# Altium schematic sheet AMS_temperature.SchDoc: Temperature Sensing
size A4; CheckedBy: Àlex Sánchez i Benet; DrawnBy: Àlex Sánchez i Benet; DocumentNumber: 1; Revision: 1; SheetNumber: 4; SheetTotal: 4; University: UPC EEBE; City: Barcelona; Country: Spain; CP: 08019; Address: Av. Eduard Maristany, 16
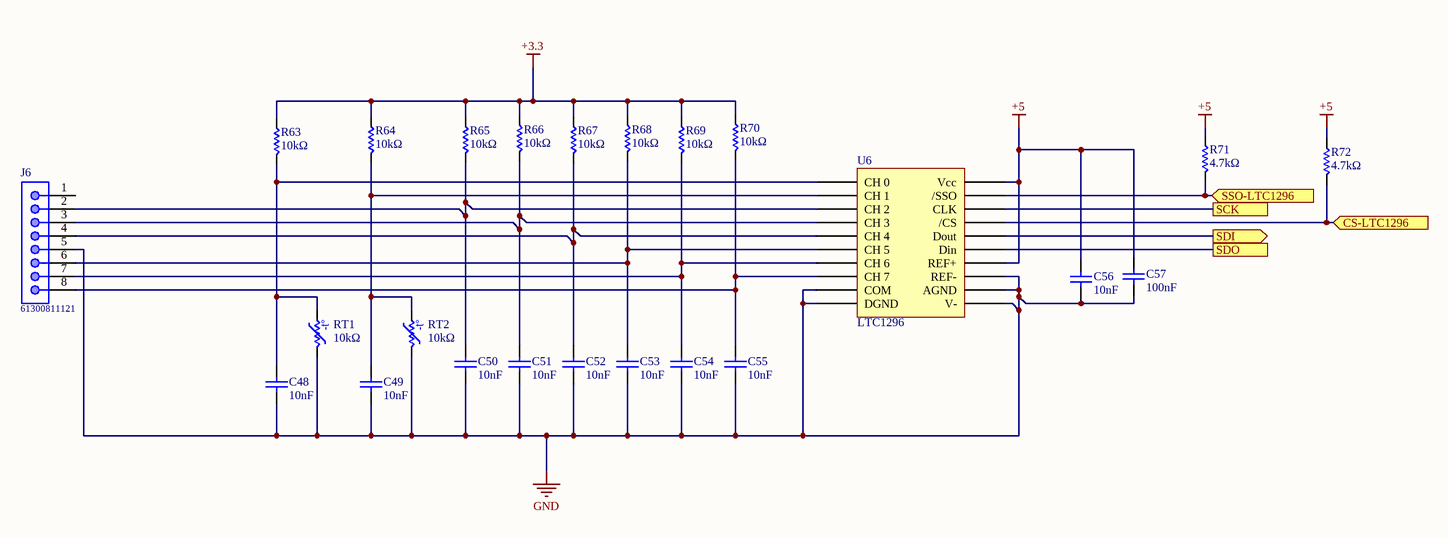
[diagram p0: AMS_temperature.SchDoc]

## Parts
C48  10nF  [0805_2x1.25x0.8mm_Reflow Soldering]
C49  10nF  [0805_2x1.25x0.8mm_Reflow Soldering]
C50  10nF  [0805_2x1.25x0.8mm_Reflow Soldering]
C51  10nF  [0805_2x1.25x0.8mm_Reflow Soldering]
C52  10nF  [0805_2x1.25x0.8mm_Reflow Soldering]
C53  10nF  [0805_2x1.25x0.8mm_Reflow Soldering]
C54  10nF  [0805_2x1.25x0.8mm_Reflow Soldering]
C55  10nF  [0805_2x1.25x0.8mm_Reflow Soldering]
C56  10nF  [0805_2x1.25x0.8mm_Reflow Soldering]
C57  100nF  [0805_2x1.25x0.8mm_Reflow Soldering]
J6  61300811121  [61300811121-bottom]
R63  10kΩ  [CR0805]
R64  10kΩ  [CR0805]
R65  10kΩ  [CR0805]
R66  10kΩ  [CR0805]
R67  10kΩ  [CR0805]
R68  10kΩ  [CR0805]
R69  10kΩ  [CR0805]
R70  10kΩ  [CR0805]
R71  4.7kΩ  [CR0805]
R72  4.7kΩ  [CR0805]
RT1  10kΩ  [NXRT15XV103FA1B040]
RT2  10kΩ  [NXRT15XV103FA1B040]
U6  LTC1296  [LTC1296]

## Ports
CS-LTC1296 (in), SCK, SDI (out), SDO, SSO-LTC1296 (in)

## Nets
+3.3: R63.2 R64.2 R65.2 R66.2 R67.2 R68.2 R69.2 R70.2
+5: C56.2 C57.2 R71.2 R72.2 U6.14(REF+) U6.20(Vcc)
GND: C48.1 C49.1 C50.1 C51.1 C52.1 C53.1 C54.1 C55.1 C56.1 C57.1 J6.5 RT1.1 RT2.1 U6.9(COM) U6.10(DGND) U6.11(V-) U6.12(AGND) U6.13(REF-)
CS-LTC1296: R72.1 U6.17(/CS) ; port CS-LTC1296
SCK: U6.18(CLK) ; port SCK
SDI: U6.16(Dout) ; port SDI
SDO: U6.15(Din) ; port SDO
SSO-LTC1296: R71.1 U6.19(/SSO) ; port SSO-LTC1296
NetC48_2: C48.2 R63.1 RT1.2 U6.1(CH_0)
NetC49_2: C49.2 R64.1 RT2.2 U6.2(CH_1)
NetC50_2: C50.2 J6.2 R65.1 U6.3(CH_2)
NetC51_2: C51.2 J6.3 R66.1 U6.4(CH_3)
NetC52_2: C52.2 J6.4 R67.1 U6.5(CH_4)
NetC53_2: C53.2 J6.6 R68.1 U6.6(CH_5)
NetC54_2: C54.2 J6.7 R69.1 U6.7(CH_6)
NetC55_2: C55.2 J6.8 R70.1 U6.8(CH_7)

Not connected (* = marked no-connect by the designer): J6 1

## Notes on the sheet
- Title
- e-Tech Racing
- UPC EEBE
- Size:
- Date:
- Drawn by:
- A4
- Number:
- Time:
- Revision:
- Sheet
- of
- Av. Eduard Maristany, 16
- 08019
- Barcelona Spain
- Made with:
- Checked by:
- (in symbol NXRT15XV103FA1B040) -t°

## Library data of the parts
C48-C56 = 885012207092: WCAP-CSGP Ceramic Capacitors, 0805, X7R, 50V, 10nF; Rated Voltage: 50V DC; ComponentLink1Description: Manufacturer; ComponentLink1URL: http://www.we-online.de; ComponentLink2Description: Datasheet; ComponentLink2URL: http://katalog.we-online.de/pbs/datasheet/885012207092.pdf; Part Number: 885012207092; Publisher: Wurth Elektronik; Size: 0805; Operating Temperature: -55 °C to +125 °C; Value: 10nF; Ceramic Type: X7R
C57 = 885012207098: WCAP-CSGP Ceramic Capacitors, 0805, X7R, 50V, 100nF; Rated Voltage: 50V DC; ComponentLink1Description: Manufacturer; ComponentLink1URL: http://www.we-online.de; ComponentLink2Description: Datasheet; ComponentLink2URL: http://katalog.we-online.de/pbs/datasheet/885012207098.pdf; Part Number: 885012207098; Publisher: Wurth Elektronik; Size: 0805; Operating Temperature: -55 °C to +125 °C; Value: 100nF; Ceramic Type: X7R
J6 = 61300811121: THT Vertical Pin Header WR-PHD, Pitch 2.54 mm, Single Row, 8 pins; Pin Number: 8; Pitch: 2.54 mm; Gender: Male; Rated Current: 3 A; Working Voltage: 250 VAC; Withstanding Voltage: 500 VAC; Contact Resistance: 20 mOhm; ComponentLink1Description: Manufacturer; ComponentLink1URL: http://www.we-online.de; ComponentLink2Description: Datasheet; ComponentLink2URL: https://katalog.we-online.de/em/datasheet/6130xx11121.pdf; Part Number: 61300811121; Published Date: August 2018; Publisher: Wurth Elektronik; Operating Temperature: -40 to 105 degC; Mounting Technology: THT; Packaging: Bag; Row Number: Single; Orientation: Vertical
R63-R70 = CR0805-JW-103ELF: Chip Resistor 0805; Manufacturer: Bourns; ComponentLink1Description: Datasheet; ComponentLink1URL: https://www.bourns.com/docs/product-datasheets/chpreztr.pdf?sfvrsn=566c91f1_11
R71 R72 = CR0805-FX-4701GLF: Chip Resistor 0805; Manufacturer: Bourns; ComponentLink1Description: Datasheet; ComponentLink1URL: https://www.bourns.com/docs/product-datasheets/chpreztr.pdf?sfvrsn=566c91f1_11
RT1 RT2 = NXRT15XV103FA1B040: NTC Thermistor Leaded type NXRT Series; Manufacturer: Murata; ComponentLink1Description: Datasheet; ComponentLink1URL: https://www.murata.com/en-global/products/productdata/8796838297630/S0423E.pdf?1482204603000; ComponentLink2Description: Catalog; ComponentLink2URL: https://www.murata.com/~/media/webrenewal/support/library/catalog/products/thermistor/ntc/r44e.ashx?la=en; Reference: NXRT15XV103FA1B040
U6 = LTC1296: ADC. Single Chip 12-Bit Data Acquisition System.; Manufacturer: Linear; NumberOfChannels: 8; Resolution: 12 bits; SupplyCurrent: 6 mA; SupplyVoltage: +/- 5V; Pins: 20; ComponentLink1Description: Datasheet; ComponentLink1URL: https://www.analog.com/media/en/technical-documentation/data-sheets/129346fs.pdf